# Altium project stm32f103zet6.PrjPCB
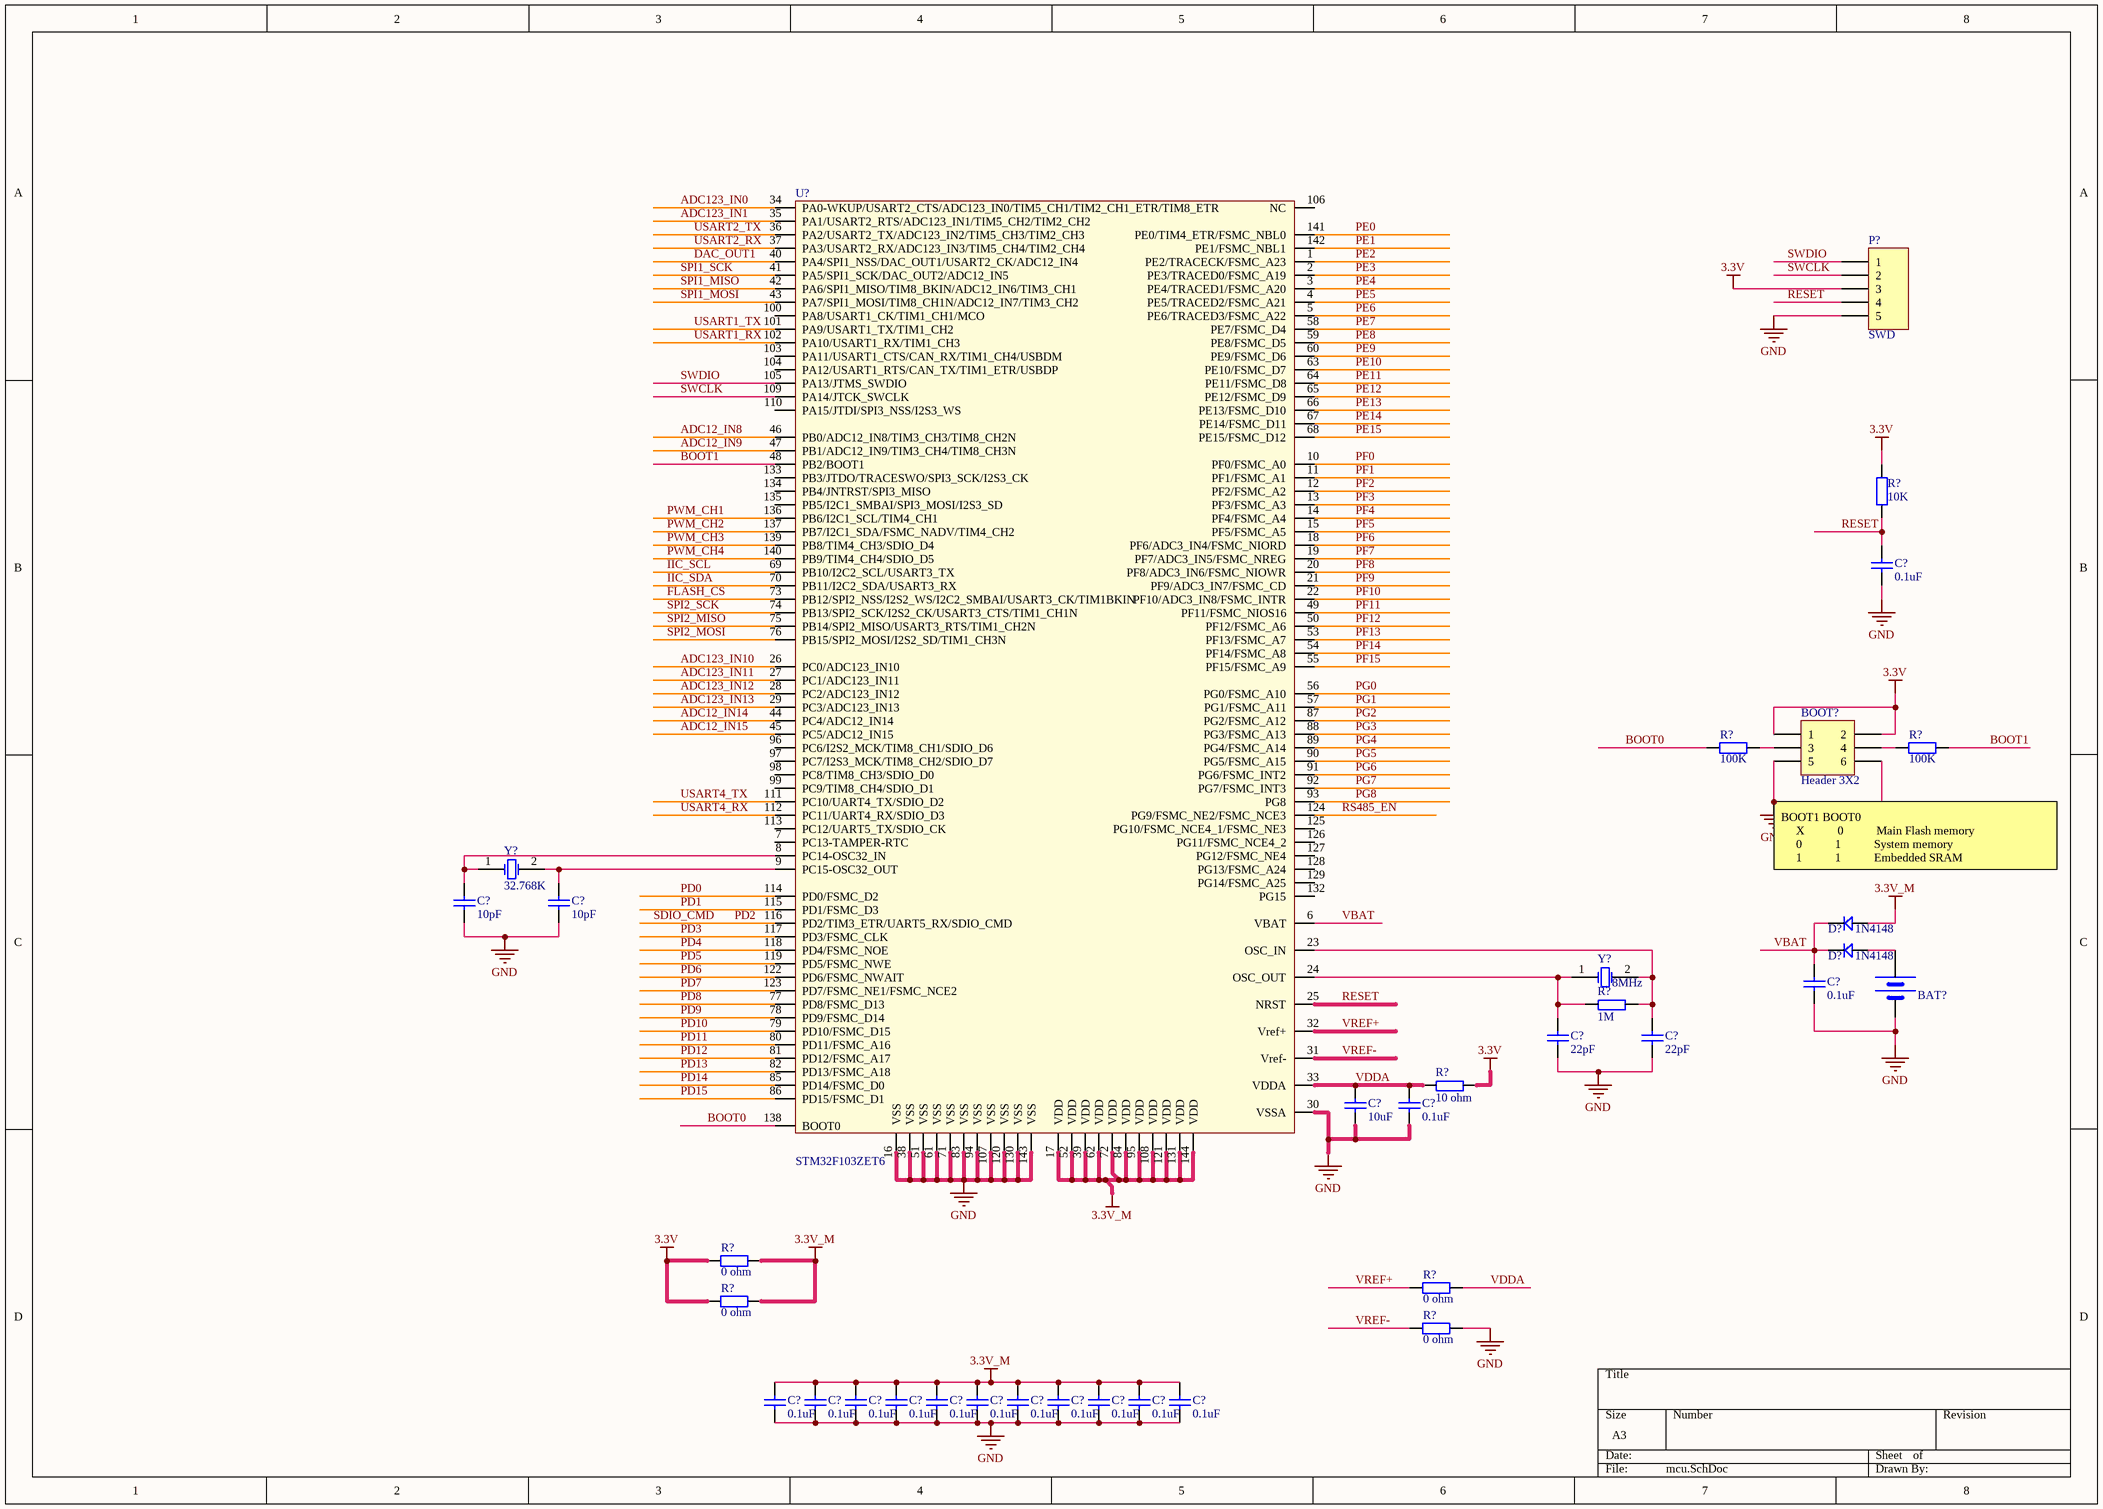
[diagram p0: mcu.SchDoc]
6 sheets, 89 parts. Net scope: hierarchical (ports join the sheet entries above them; power ports are global).
Sheets:
  mcu.SchDoc
  Top2.SchDoc
  DO.SchDoc
  DI.SchDoc
  pwm.SchDoc
  SIM900.SchDoc

## Sheet mcu.SchDoc
size A3

### Parts
(Parts that share a designator on the sheet are numbered #1, #2 ... from top to bottom, then left to right.)
BAT?  BATT  [BATM]  (value not drawn)
BOOT?  Header 3X2  [HDR2X3]
C?#1  value 0.1uF  [0805]  (hidden comment: Cap)
C?#2  value 10pF  [0805]  (hidden comment: Cap)
C?#3  value 10pF  [0805]  (hidden comment: Cap)
C?#4  value 0.1uF  [0805]  (hidden comment: Cap)
C?#5  value 22pF  [0805]  (hidden comment: Cap)
C?#6  value 22pF  [0805]  (hidden comment: Cap)
C?#7  value 10uF  [1206]  (hidden comment: Cap)
C?#8  value 0.1uF  [0805]  (hidden comment: Cap)
C?#9  value 0.1uF  [0805]  (hidden comment: Cap)
C?#10  value 0.1uF  [0805]  (hidden comment: Cap)
C?#11  value 0.1uF  [0805]  (hidden comment: Cap)
C?#12  value 0.1uF  [0805]  (hidden comment: Cap)
C?#13  value 0.1uF  [0805]  (hidden comment: Cap)
C?#14  value 0.1uF  [0805]  (hidden comment: Cap)
C?#15  value 0.1uF  [0805]  (hidden comment: Cap)
C?#16  value 0.1uF  [0805]  (hidden comment: Cap)
C?#17  value 0.1uF  [0805]  (hidden comment: Cap)
C?#18  value 0.1uF  [0805]  (hidden comment: Cap)
C?#19  value 0.1uF  [0805]  (hidden comment: Cap)
D?#1  1N4148  [DIODE_SOP]
D?#2  1N4148  [DIODE_SOP]
P?  SWD  [HDR1X5]
R?#1  value 10K  [0805]
R?#2  value 100K  [0805]
R?#3  value 100K  [0805]
R?#4  1M  [0805]
R?#5  10 ohm  [0805]
R?#6  value 0 ohm  [0805]
R?#7  value 0 ohm  [0805]
R?#8  value 0 ohm  [0805]
R?#9  value 0 ohm  [0805]
U?#1  STM32F103ZET6  [LQFP144]
Y?#1  32.768K  [XTAL32]
Y?#2  8MHz  [XTAL_US]

### Nets
3.3V: BOOT?.1 BOOT?.2 P?.3 R?#1.2 R?#5.2 R?#6.2 R?#8.2
3.3V_M: C?#9.2 C?#10.2 C?#11.2 C?#12.2 C?#13.2 C?#14.2 C?#15.2 C?#16.2 C?#17.2 C?#18.2 C?#19.2 D?#1.1 R?#6.1 R?#8.1 U?#1.17(VDD) U?#1.39(VDD) U?#1.52(VDD) U?#1.62(VDD) U?#1.72(VDD) U?#1.84(VDD) U?#1.95(VDD) U?#1.108(VDD) U?#1.121(VDD) U?#1.131(VDD) U?#1.144(VDD)
GND: BAT?.2(GND) BOOT?.5 BOOT?.6 C?#1.1 C?#2.1 C?#3.1 C?#4.1 C?#5.1 C?#6.1 C?#7.1 C?#8.1 C?#9.1 C?#10.1 C?#11.1 C?#12.1 C?#13.1 C?#14.1 C?#15.1 C?#16.1 C?#17.1 C?#18.1 C?#19.1 P?.5 R?#9.1 U?#1.16(VSS) U?#1.30(VSSA) U?#1.38(VSS) U?#1.51(VSS) U?#1.61(VSS) U?#1.71(VSS) U?#1.83(VSS) U?#1.94(VSS) U?#1.107(VSS) U?#1.120(VSS) U?#1.130(VSS) U?#1.143(VSS)
ADC12_IN8: U?#1.46(PB0/ADC12_IN8/TIM3_CH3/TIM8_CH2N)
ADC12_IN9: U?#1.47(PB1/ADC12_IN9/TIM3_CH4/TIM8_CH3N)
ADC12_IN14: U?#1.44(PC4/ADC12_IN14)
ADC12_IN15: U?#1.45(PC5/ADC12_IN15)
ADC123_IN0: U?#1.34(PA0-WKUP/USART2_CTS/ADC123_IN0/TIM5_CH1/TIM2_CH1_ETR/TIM8_ETR)
ADC123_IN1: U?#1.35(PA1/USART2_RTS/ADC123_IN1/TIM5_CH2/TIM2_CH2)
ADC123_IN10: U?#1.26(PC0/ADC123_IN10)
ADC123_IN11: U?#1.27(PC1/ADC123_IN11)
ADC123_IN12: U?#1.28(PC2/ADC123_IN12)
ADC123_IN13: U?#1.29(PC3/ADC123_IN13)
BOOT0: R?#2.2 U?#1.138(BOOT0)
BOOT1: R?#3.1 U?#1.48(PB2/BOOT1)
DAC_OUT1: U?#1.40(PA4/SPI1_NSS/DAC_OUT1/USART2_CK/ADC12_IN4)
FLASH_CS: U?#1.73(PB12/SPI2_NSS/I2S2_WS/I2C2_SMBAI/USART3_CK/TIM1BKIN)
IIC_SCL: U?#1.69(PB10/I2C2_SCL/USART3_TX)
IIC_SDA: U?#1.70(PB11/I2C2_SDA/USART3_RX)
PD0: U?#1.114(PD0/FSMC_D2)
PD1: U?#1.115(PD1/FSMC_D3)
PD2: U?#1.116(PD2/TIM3_ETR/UART5_RX/SDIO_CMD)  [also labelled SDIO_CMD]
PD3: U?#1.117(PD3/FSMC_CLK)
PD4: U?#1.118(PD4/FSMC_NOE)
PD5: U?#1.119(PD5/FSMC_NWE)
PD6: U?#1.122(PD6/FSMC_NWAIT)
PD7: U?#1.123(PD7/FSMC_NE1/FSMC_NCE2)
PD8: U?#1.77(PD8/FSMC_D13)
PD9: U?#1.78(PD9/FSMC_D14)
PD10: U?#1.79(PD10/FSMC_D15)
PD11: U?#1.80(PD11/FSMC_A16)
PD12: U?#1.81(PD12/FSMC_A17)
PD13: U?#1.82(PD13/FSMC_A18)
PD14: U?#1.85(PD14/FSMC_D0)
PD15: U?#1.86(PD15/FSMC_D1)
PE0: U?#1.141(PE0/TIM4_ETR/FSMC_NBL0)
PE1: U?#1.142(PE1/FSMC_NBL1)
PE2: U?#1.1(PE2/TRACECK/FSMC_A23)
PE3: U?#1.2(PE3/TRACED0/FSMC_A19)
PE4: U?#1.3(PE4/TRACED1/FSMC_A20)
PE5: U?#1.4(PE5/TRACED2/FSMC_A21)
PE6: U?#1.5(PE6/TRACED3/FSMC_A22)
PE7: U?#1.58(PE7/FSMC_D4)
PE8: U?#1.59(PE8/FSMC_D5)
PE9: U?#1.60(PE9/FSMC_D6)
PE10: U?#1.63(PE10/FSMC_D7)
PE11: U?#1.64(PE11/FSMC_D8)
PE12: U?#1.65(PE12/FSMC_D9)
PE13: U?#1.66(PE13/FSMC_D10)
PE14: U?#1.67(PE14/FSMC_D11)
PE15: U?#1.68(PE15/FSMC_D12)
PF0: U?#1.10(PF0/FSMC_A0)
PF1: U?#1.11(PF1/FSMC_A1)
PF2: U?#1.12(PF2/FSMC_A2)
PF3: U?#1.13(PF3/FSMC_A3)
PF4: U?#1.14(PF4/FSMC_A4)
PF5: U?#1.15(PF5/FSMC_A5)
PF6: U?#1.18(PF6/ADC3_IN4/FSMC_NIORD)
PF7: U?#1.19(PF7/ADC3_IN5/FSMC_NREG)
PF8: U?#1.20(PF8/ADC3_IN6/FSMC_NIOWR)
PF9: U?#1.21(PF9/ADC3_IN7/FSMC_CD)
PF10: U?#1.22(PF10/ADC3_IN8/FSMC_INTR)
PF11: U?#1.49(PF11/FSMC_NIOS16)
PF12: U?#1.50(PF12/FSMC_A6)
PF13: U?#1.53(PF13/FSMC_A7)
PF14: U?#1.54(PF14/FSMC_A8)
PF15: U?#1.55(PF15/FSMC_A9)
PG0: U?#1.56(PG0/FSMC_A10)
PG1: U?#1.57(PG1/FSMC_A11)
PG2: U?#1.87(PG2/FSMC_A12)
PG3: U?#1.88(PG3/FSMC_A13)
PG4: U?#1.89(PG4/FSMC_A14)
PG5: U?#1.90(PG5/FSMC_A15)
PG6: U?#1.91(PG6/FSMC_INT2)
PG7: U?#1.92(PG7/FSMC_INT3)
PG8: U?#1.93(PG8)
PWM_CH1: U?#1.136(PB6/I2C1_SCL/TIM4_CH1)
PWM_CH2: U?#1.137(PB7/I2C1_SDA/FSMC_NADV/TIM4_CH2)
PWM_CH3: U?#1.139(PB8/TIM4_CH3/SDIO_D4)
PWM_CH4: U?#1.140(PB9/TIM4_CH4/SDIO_D5)
RESET: C?#1.2 P?.4 R?#1.1 U?#1.25(NRST)
RS485_EN: U?#1.124(PG9/FSMC_NE2/FSMC_NCE3)
SPI1_MISO: U?#1.42(PA6/SPI1_MISO/TIM8_BKIN/ADC12_IN6/TIM3_CH1)
SPI1_MOSI: U?#1.43(PA7/SPI1_MOSI/TIM8_CH1N/ADC12_IN7/TIM3_CH2)
SPI1_SCK: U?#1.41(PA5/SPI1_SCK/DAC_OUT2/ADC12_IN5)
SPI2_MISO: U?#1.75(PB14/SPI2_MISO/USART3_RTS/TIM1_CH2N)
SPI2_MOSI: U?#1.76(PB15/SPI2_MOSI/I2S2_SD/TIM1_CH3N)
SPI2_SCK: U?#1.74(PB13/SPI2_SCK/I2S2_CK/USART3_CTS/TIM1_CH1N)
SWCLK: P?.2 U?#1.109(PA14/JTCK_SWCLK)
SWDIO: P?.1 U?#1.105(PA13/JTMS_SWDIO)
USART1_RX: U?#1.102(PA10/USART1_RX/TIM1_CH3)
USART1_TX: U?#1.101(PA9/USART1_TX/TIM1_CH2)
USART2_RX: U?#1.37(PA3/USART2_RX/ADC123_IN3/TIM5_CH4/TIM2_CH4)
USART2_TX: U?#1.36(PA2/USART2_TX/ADC123_IN2/TIM5_CH3/TIM2_CH3)
USART4_RX: U?#1.112(PC11/UART4_RX/SDIO_D3)
USART4_TX: U?#1.111(PC10/UART4_TX/SDIO_D2)
VBAT: C?#4.2 D?#1.2 D?#2.2 U?#1.6(VBAT)
VDDA: C?#7.2 C?#8.2 R?#5.1 R?#7.1 U?#1.33(VDDA)
VREF+: R?#7.2 U?#1.32(Vref+)
VREF-: R?#9.2 U?#1.31(Vref-)
NetBAT?_1: BAT?.1(VCC) D?#2.1
NetBOOT?_3: BOOT?.3 R?#2.1
NetBOOT?_4: BOOT?.4 R?#3.2
NetC?#2_2: C?#2.2 U?#1.8(PC14-OSC32_IN) Y?#1.1(OSC1)
NetC?#3_2: C?#3.2 U?#1.9(PC15-OSC32_OUT) Y?#1.2(OSC2)
NetC?#5_2: C?#5.2 R?#4.1 U?#1.24(OSC_OUT) Y?#2.1(OSC1)
NetC?#6_2: C?#6.2 R?#4.2 U?#1.23(OSC_IN) Y?#2.2(OSC2)

Not connected (* = marked no-connect by the designer): U?#1 7(PC13-TAMPER-RTC) 96(PC6/I2S2_MCK/TIM8_CH1/SDIO_D6) 97(PC7/I2S3_MCK/TIM8_CH2/SDIO_D7) 98(PC8/TIM8_CH3/SDIO_D0) 99(PC9/TIM8_CH4/SDIO_D1) 100(PA8/USART1_CK/TIM1_CH1/MCO) 103(PA11/USART1_CTS/CAN_RX/TIM1_CH4/USBDM) 104(PA12/USART1_RTS/CAN_TX/TIM1_ETR/USBDP) 106(NC) 110(PA15/JTDI/SPI3_NSS/I2S3_WS) 113(PC12/UART5_TX/SDIO_CK) 125(PG10/FSMC_NCE4_1/FSMC_NE3) 126(PG11/FSMC_NCE4_2) 127(PG12/FSMC_NE4) 128(PG13/FSMC_A24) 129(PG14/FSMC_A25) 132(PG15) 133(PB3/JTDO/TRACESWO/SPI3_SCK/I2S3_CK) 134(PB4/JNTRST/SPI3_MISO) 135(PB5/I2C1_SMBAI/SPI3_MOSI/I2S3_SD)

### Notes on the sheet
- BOOT1 BOOT0
  X           0           Main Flash memory
  0           1           System memory
  1           1           Embedded SRAM

### Library data of the parts
BAT? = BAT
BOOT? = Header 3X2: Header, 3-Pin, Dual row; LatestRevisionDate: 17-Jul-2002; LatestRevisionNote: Re-released for DXP Platform.; Publisher: Altium Limited
C?#1-C?#19 = Cap: Capacitor; Published: 8-Jun-2000; LatestRevisionDate: 17-Jul-2002; LatestRevisionNote: Re-released for DXP Platform.; PackageReference: RAD-0.3; Publisher: Altium Limited; PackageDescription: Radial Cap, Thru-Hole; 2 Leads; 0.3 in Pin Spacing
D?#1 D?#2 = D
P? = Header 5: Header, 5-Pin; LatestRevisionDate: 17-Jul-2002; LatestRevisionNote: Re-released for DXP Platform.; Publisher: Altium Limited
R?#1-R?#3 R?#6-R?#9 = Res2: Resistor; Published: 8-Jun-2000; LatestRevisionDate: 17-Jul-2002; LatestRevisionNote: Re-released for DXP Platform.; PackageReference: AXIAL-0.4; Publisher: Altium Limited; PackageDescription: Axial Device, Thru-Hole; 2 Leads; 0.4 in Pin Spacing
R?#4 R?#5 = R
Y?#1 = XTAL_1: Crystal Oscillator; Published: 8-Jun-2000; LatestRevisionDate: 17-Jul-2002; LatestRevisionNote: Re-released for DXP Platform.; Publisher: Altium Limited
Y?#2 = XTAL: Crystal Oscillator; Published: 8-Jun-2000; LatestRevisionDate: 17-Jul-2002; LatestRevisionNote: Re-released for DXP Platform.; Publisher: Altium Limited

## Sheet Top2.SchDoc
size A3
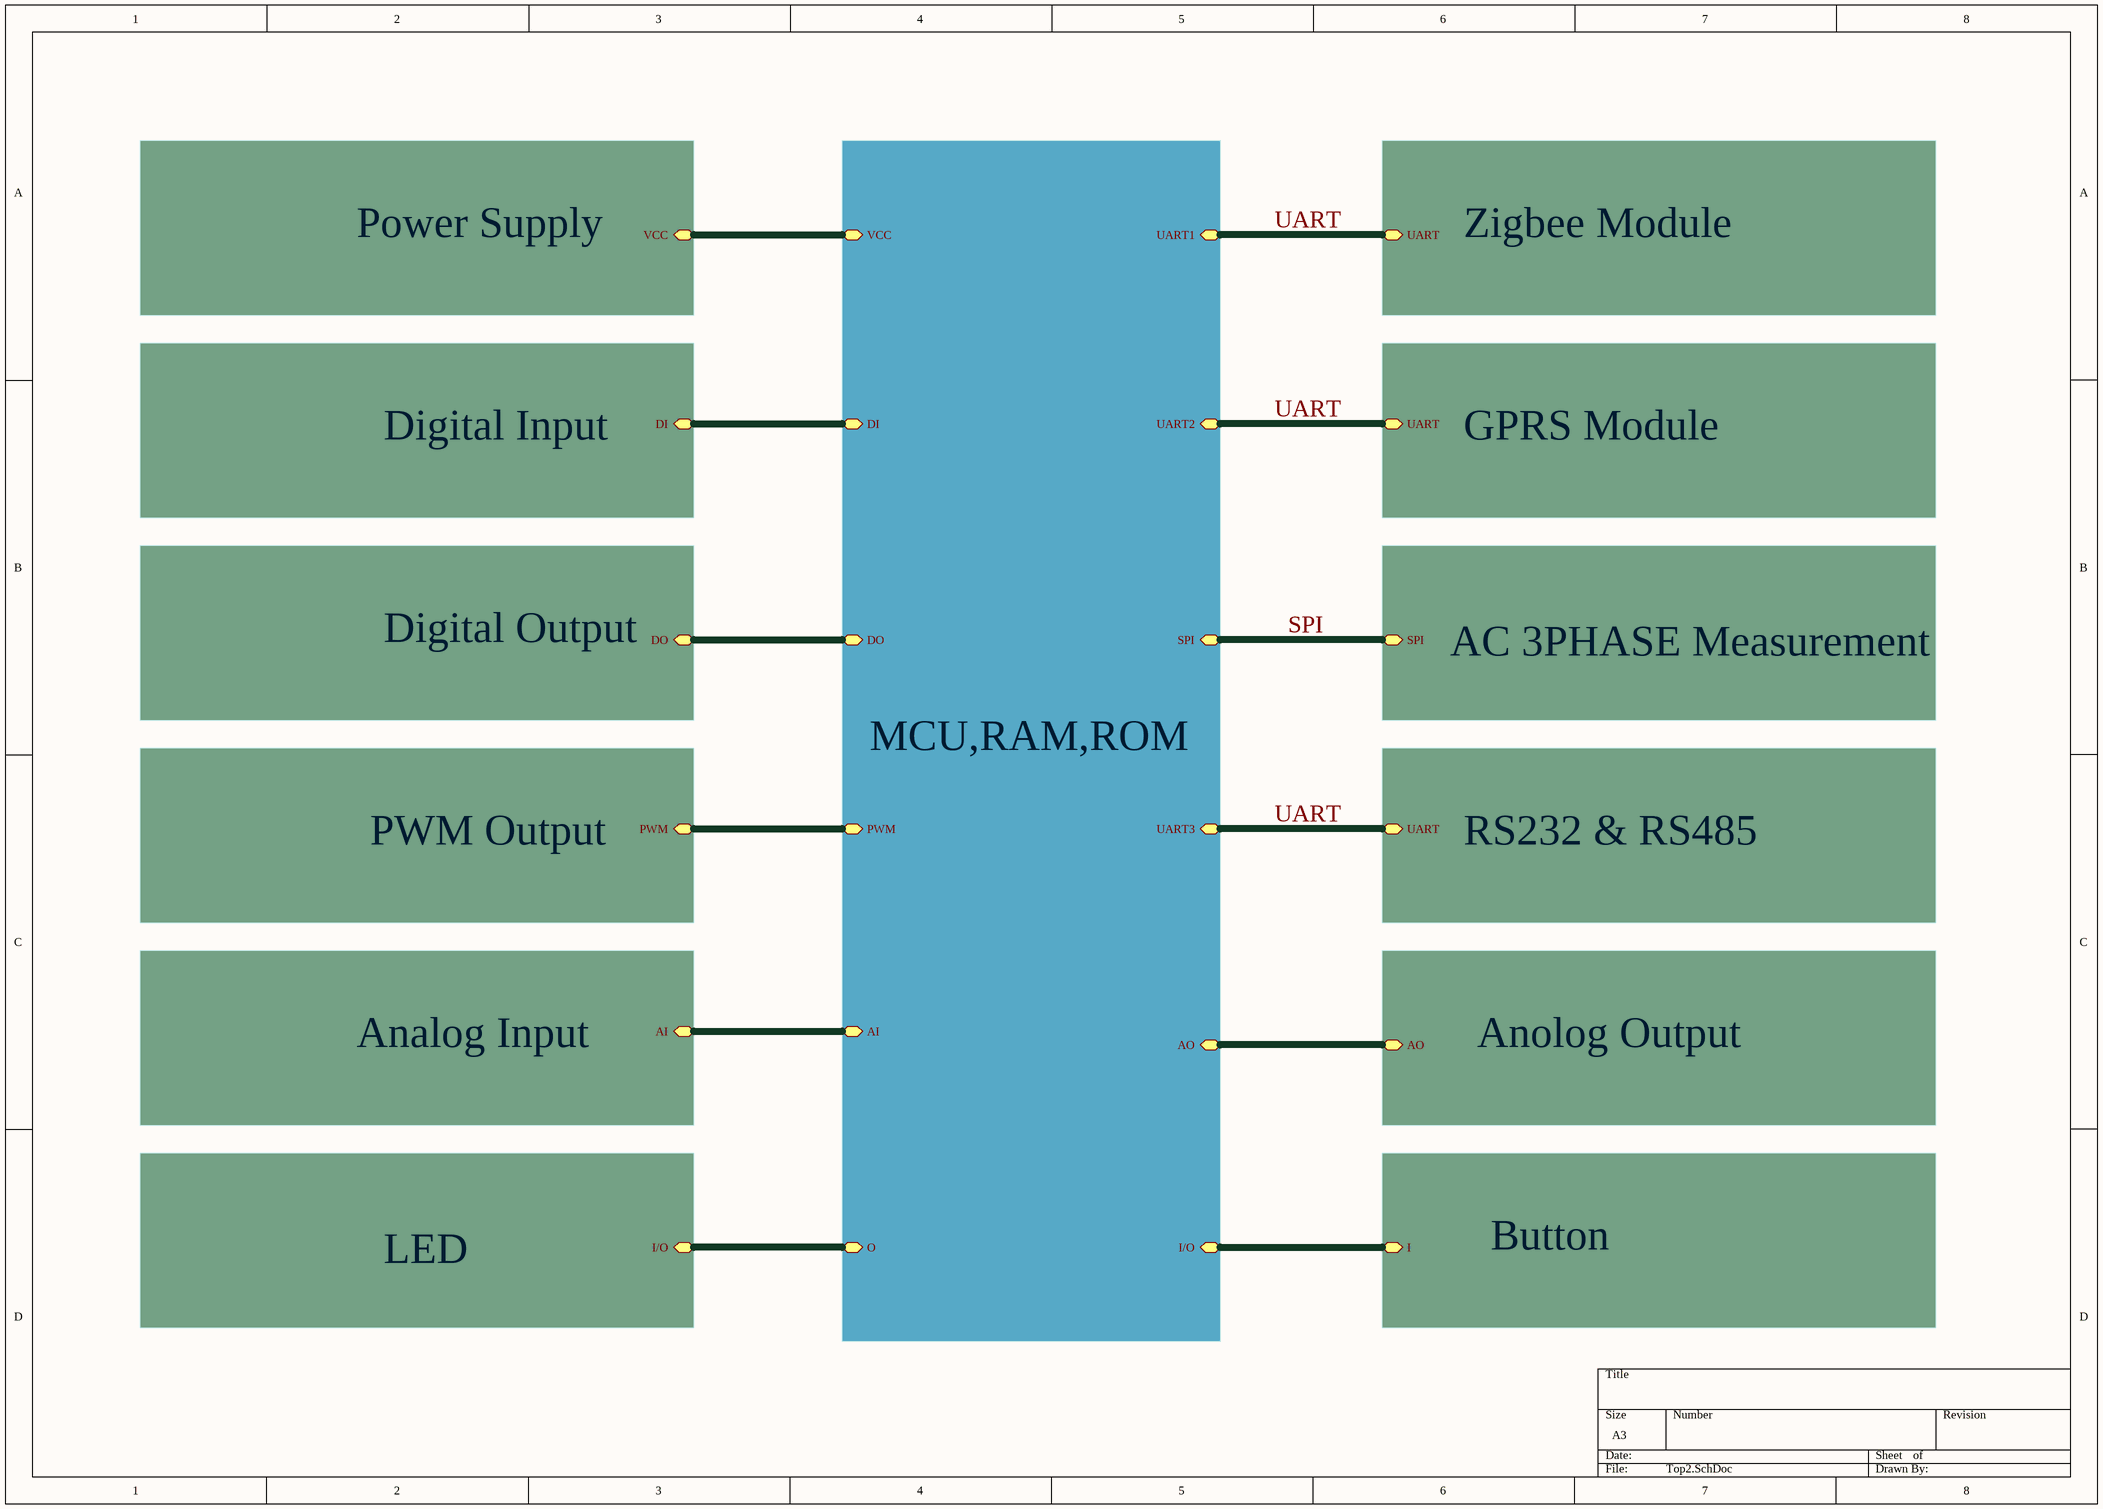
[diagram p1: Top2.SchDoc]

### Sub-sheets
AC 3PHASE Measurement = ?: SPI
Analog Input = ?: AI
Anolog Output = ?: AO
Button = ?: I
Digital Input = ?: DI
Digital Output = ?: DO
GPRS Module = ?: UART
LED = ?: I/O
MCU,RAM,ROM = ?: DI, DO, PWM, AI, O, AO, UART3, SPI, UART2, UART1, I/O, VCC
Power Supply = ?: VCC
PWM Output = ?: PWM
RS232 & RS485 = ?: UART
Zigbee Module = ?: UART

### Nets
SPI: sheet MCU,RAM,ROM/SPI, sheet AC 3PHASE Measurement/SPI
UART: sheet MCU,RAM,ROM/UART3, sheet MCU,RAM,ROM/UART2, sheet MCU,RAM,ROM/UART1, sheet GPRS Module/UART, sheet RS232 & RS485/UART, sheet Zigbee Module/UART
(unnamed): sheet MCU,RAM,ROM/DI, sheet Digital Input/DI
(unnamed): sheet MCU,RAM,ROM/DO, sheet Digital Output/DO
(unnamed): sheet MCU,RAM,ROM/PWM, sheet PWM Output/PWM
(unnamed): sheet MCU,RAM,ROM/AI, sheet Analog Input/AI
(unnamed): sheet MCU,RAM,ROM/O, sheet LED/I/O
(unnamed): sheet MCU,RAM,ROM/AO, sheet Anolog Output/AO
(unnamed): sheet MCU,RAM,ROM/I/O, sheet Button/I
(unnamed): sheet MCU,RAM,ROM/VCC, sheet Power Supply/VCC

## Sheet DO.SchDoc
size A3
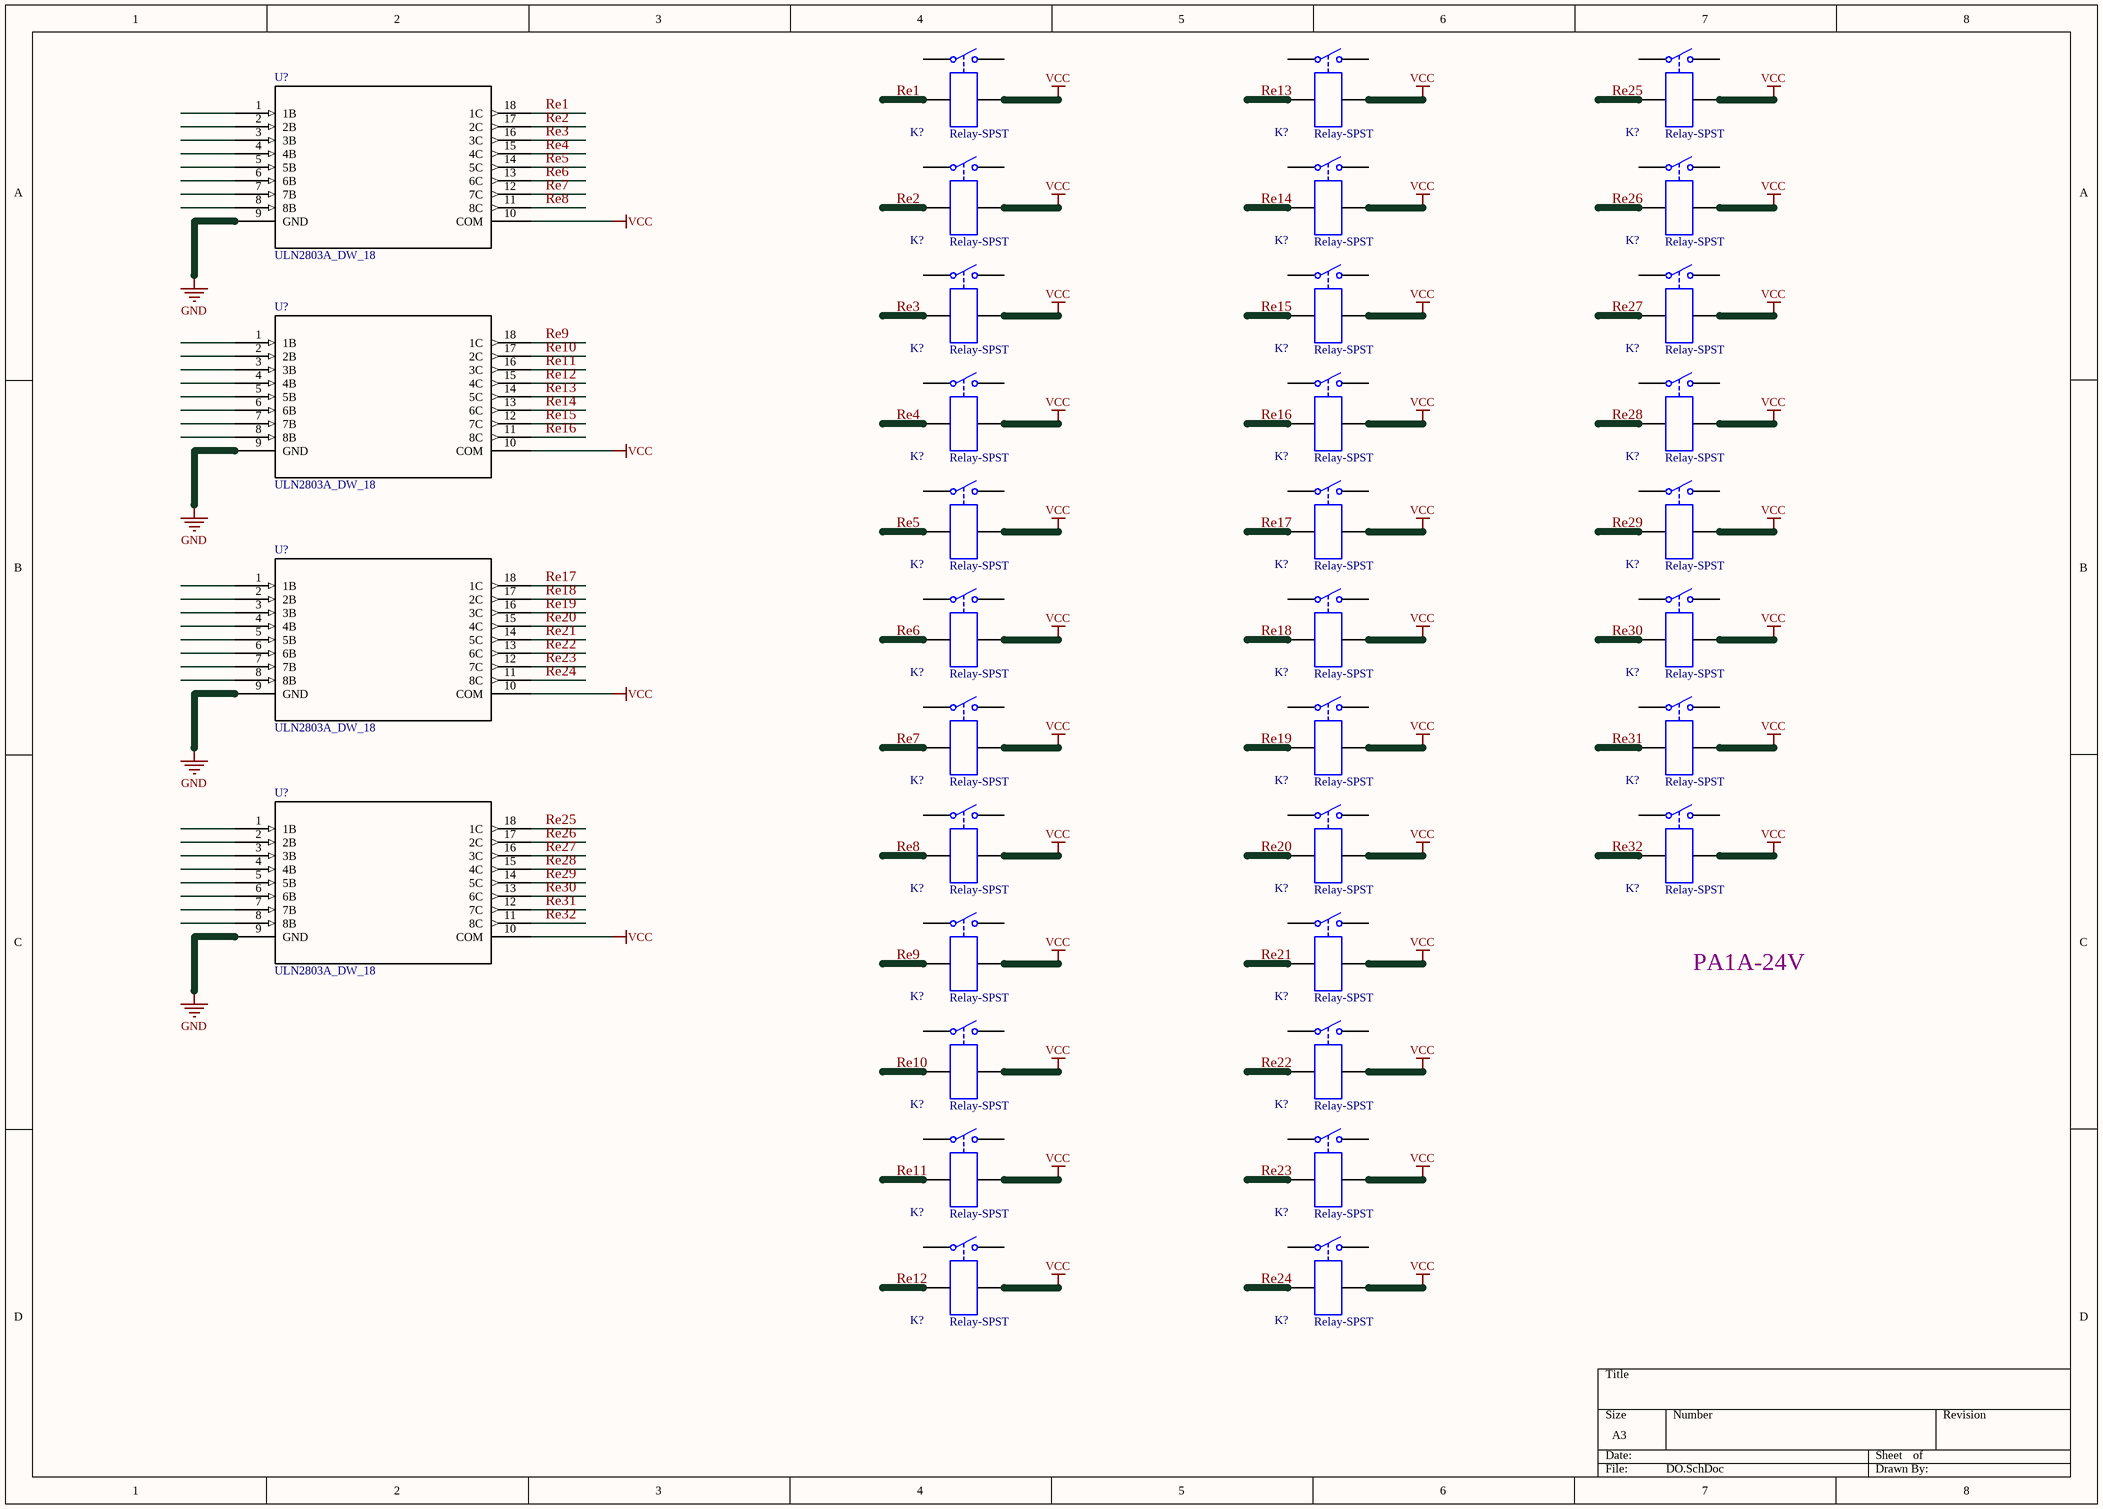
[diagram p2: DO.SchDoc]

### Parts
(Parts that share a designator on the sheet are numbered #1, #2 ... from top to bottom, then left to right.)
K?#1  Relay-SPST  [MODULE4]
K?#2  Relay-SPST  [MODULE4]
K?#3  Relay-SPST  [MODULE4]
K?#4  Relay-SPST  [MODULE4]
K?#5  Relay-SPST  [MODULE4]
K?#6  Relay-SPST  [MODULE4]
K?#7  Relay-SPST  [MODULE4]
K?#8  Relay-SPST  [MODULE4]
K?#9  Relay-SPST  [MODULE4]
K?#10  Relay-SPST  [MODULE4]
K?#11  Relay-SPST  [MODULE4]
K?#12  Relay-SPST  [MODULE4]
K?#13  Relay-SPST  [MODULE4]
K?#14  Relay-SPST  [MODULE4]
K?#15  Relay-SPST  [MODULE4]
K?#16  Relay-SPST  [MODULE4]
K?#17  Relay-SPST  [MODULE4]
K?#18  Relay-SPST  [MODULE4]
K?#19  Relay-SPST  [MODULE4]
K?#20  Relay-SPST  [MODULE4]
K?#21  Relay-SPST  [MODULE4]
K?#22  Relay-SPST  [MODULE4]
K?#23  Relay-SPST  [MODULE4]
K?#24  Relay-SPST  [MODULE4]
K?#25  Relay-SPST  [MODULE4]
K?#26  Relay-SPST  [MODULE4]
K?#27  Relay-SPST  [MODULE4]
K?#28  Relay-SPST  [MODULE4]
K?#29  Relay-SPST  [MODULE4]
K?#30  Relay-SPST  [MODULE4]
K?#31  Relay-SPST  [MODULE4]
K?#32  Relay-SPST  [MODULE4]
U?#2  ULN2803A_DW_18  [DW18]
U?#3  ULN2803A_DW_18  [DW18]
U?#4  ULN2803A_DW_18  [DW18]
U?#5  ULN2803A_DW_18  [DW18]

### Nets
GND: U?#2.9(GND) U?#3.9(GND) U?#4.9(GND) U?#5.9(GND)
VCC: K?#1.4 K?#2.4 K?#3.4 K?#4.4 K?#5.4 K?#6.4 K?#7.4 K?#8.4 K?#9.4 K?#10.4 K?#11.4 K?#12.4 K?#13.4 K?#14.4 K?#15.4 K?#16.4 K?#17.4 K?#18.4 K?#19.4 K?#20.4 K?#21.4 K?#22.4 K?#23.4 K?#24.4 K?#25.4 K?#26.4 K?#27.4 K?#28.4 K?#29.4 K?#30.4 K?#31.4 K?#32.4 U?#2.10(COM) U?#3.10(COM) U?#4.10(COM) U?#5.10(COM)
Re1: K?#1.3 U?#2.18(1C)
Re2: K?#4.3 U?#2.17(2C)
Re3: K?#7.3 U?#2.16(3C)
Re4: K?#10.3 U?#2.15(4C)
Re5: K?#13.3 U?#2.14(5C)
Re6: K?#16.3 U?#2.13(6C)
Re7: K?#19.3 U?#2.12(7C)
Re8: K?#22.3 U?#2.11(8C)
Re9: K?#25.3 U?#3.18(1C)
Re10: K?#27.3 U?#3.17(2C)
Re11: K?#29.3 U?#3.16(3C)
Re12: K?#31.3 U?#3.15(4C)
Re13: K?#2.3 U?#3.14(5C)
Re14: K?#5.3 U?#3.13(6C)
Re15: K?#8.3 U?#3.12(7C)
Re16: K?#11.3 U?#3.11(8C)
Re17: K?#14.3 U?#4.18(1C)
Re18: K?#17.3 U?#4.17(2C)
Re19: K?#20.3 U?#4.16(3C)
Re20: K?#23.3 U?#4.15(4C)
Re21: K?#26.3 U?#4.14(5C)
Re22: K?#28.3 U?#4.13(6C)
Re23: K?#30.3 U?#4.12(7C)
Re24: K?#32.3 U?#4.11(8C)
Re25: K?#3.3 U?#5.18(1C)
Re26: K?#6.3 U?#5.17(2C)
Re27: K?#9.3 U?#5.16(3C)
Re28: K?#12.3 U?#5.15(4C)
Re29: K?#15.3 U?#5.14(5C)
Re30: K?#18.3 U?#5.13(6C)
Re31: K?#21.3 U?#5.12(7C)
Re32: K?#24.3 U?#5.11(8C)

Not connected (* = marked no-connect by the designer): K?#1 1 2; K?#2 1 2; K?#3 1 2; K?#4 1 2; K?#5 1 2; K?#6 1 2; K?#7 1 2; K?#8 1 2; K?#9 1 2; K?#10 1 2; K?#11 1 2; K?#12 1 2; K?#13 1 2; K?#14 1 2; K?#15 1 2; K?#16 1 2; K?#17 1 2; K?#18 1 2; K?#19 1 2; K?#20 1 2; K?#21 1 2; K?#22 1 2; K?#23 1 2; K?#24 1 2; K?#25 1 2; K?#26 1 2; K?#27 1 2; K?#28 1 2; K?#29 1 2; K?#30 1 2; K?#31 1 2; K?#32 1 2; U?#2 1(1B) 2(2B) 3(3B) 4(4B) 5(5B) 6(6B) 7(7B) 8(8B); U?#3 1(1B) 2(2B) 3(3B) 4(4B) 5(5B) 6(6B) 7(7B) 8(8B); U?#4 1(1B) 2(2B) 3(3B) 4(4B) 5(5B) 6(6B) 7(7B) 8(8B); U?#5 1(1B) 2(2B) 3(3B) 4(4B) 5(5B) 6(6B) 7(7B) 8(8B)

### Notes on the sheet
- PA1A-24V

### Library data of the parts
K?#1-K?#32 = Relay-SPST: Single-Pole Single-Throw Relay; Published: 24-Mar-1999; LatestRevisionDate: 17-Jul-2002; LatestRevisionNote: Re-released for DXP Platform.; PackageReference: MODULE4; Publisher: Altium Limited
U?#2-U?#5 = ULN2803A_DW_18: Imported; Manufacturer: Texas Instruments; INDUSTRY_STD_PKG_TYPE: SOIC; FAMILY_NAME: PERIPHERAL DRIVER AND ACTUATOR; PIN_COUNT: 18; PACKAGE_DESIGNATOR: DW; Datasheet URL: http://www.ti.com/lit/gpn/ULN2803A; GENERIC_PART_NUMBER: ULN2803A; RefDes: RefDes; Type: DEV; Value: Value

## Sheet DI.SchDoc
size A4
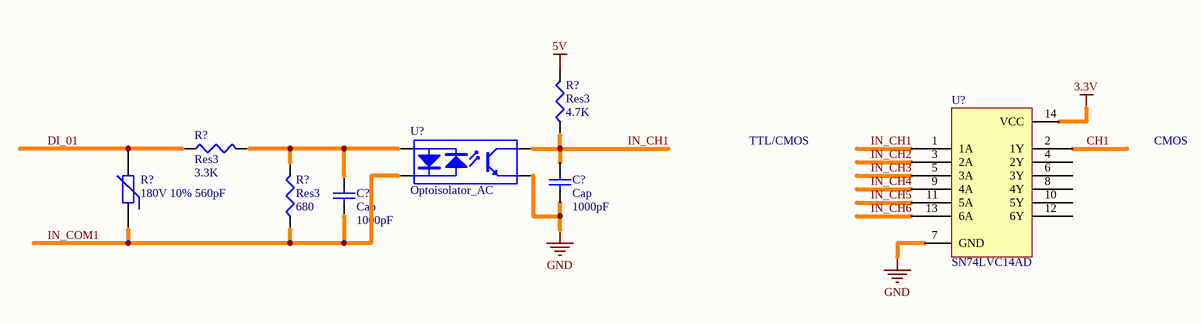
[diagram p3: DI.SchDoc]

### Parts
(Parts that share a designator on the sheet are numbered #1, #2 ... from top to bottom, then left to right.)
C?#20  Cap  value 1000pF  [RAD-0.3]
C?#21  Cap  value 1000pF  [RAD-0.3]
R?#10  Res3  value 4.7K  [J1-0603]
R?#11  Res3  value 3.3K  [J1-0603]
R?#12  180V 10% 560pF
R?#13  Res3  value 680  [J1-0603]
U?#6  SN74LVC14AD  [SOIC-14]
U?#7  Optoisolator_AC

### Nets
3.3V: U?#6.14(VCC)
5V: R?#10.2
GND: C?#20.1 U?#6.7(GND) U?#7.3(E)
CH1: U?#6.2(1Y)
DI_01: R?#11.1 R?#12.2
IN_CH1: C?#20.2 R?#10.1 U?#6.1(1A) U?#7.4(C)
IN_CH2: U?#6.3(2A)
IN_CH3: U?#6.5(3A)
IN_CH4: U?#6.9(4A)
IN_CH5: U?#6.11(5A)
IN_CH6: U?#6.13(6A)
IN_COM1: C?#21.1 R?#12.1 R?#13.1 U?#7.2(K)
NetC?#21_2: C?#21.2 R?#11.2 R?#13.2 U?#7.1(A)

Not connected (* = marked no-connect by the designer): U?#6 4(2Y) 6(3Y) 8(4Y) 10(5Y) 12(6Y)

### Notes on the sheet
- TTL/CMOS
- CMOS

### Library data of the parts
C?#20 C?#21 = Cap: Capacitor; Published: 8-Jun-2000; LatestRevisionDate: 17-Jul-2002; LatestRevisionNote: Re-released for DXP Platform.; PackageReference: RAD-0.3; Publisher: Altium Limited; PackageDescription: Radial Cap, Thru-Hole; 2 Leads; 0.3 in Pin Spacing
R?#10 R?#11 R?#13 = Res3: Resistor; Published: 8-Jun-2000; LatestRevisionDate: 29-May-2009; LatestRevisionNote: IPC-7351 Footprint Added.; PackageReference: J1-0603; Publisher: Altium Limited; PackageDescription: Chip Resistor
R?#12 = Res Varistor: Varistor (Voltage-Sensitive Resistor); Mf: Bourns; Mf P/N: 10D181K; HelpURL: http://www.bourns.com/data/global/pdfs/MOV10D.pdf
U?#6 = SN74LVC240ADBLE: SNx4LVC14A Hex Schmitt-Trigger Inverters; Mfg: TI; Mfg P/N: SN74LVC14AD; HelpURL: http://www.ti.com.cn/cn/lit/ds/symlink/sn74lvc14a.pdf
U?#7 = Optoisolator_AC: 4-Pin Phototransistor Optocoupler; HelpURL: http://www.cel.com/pdf/datasheets/ps2705a1.pdf

## Sheet pwm.SchDoc
size A4
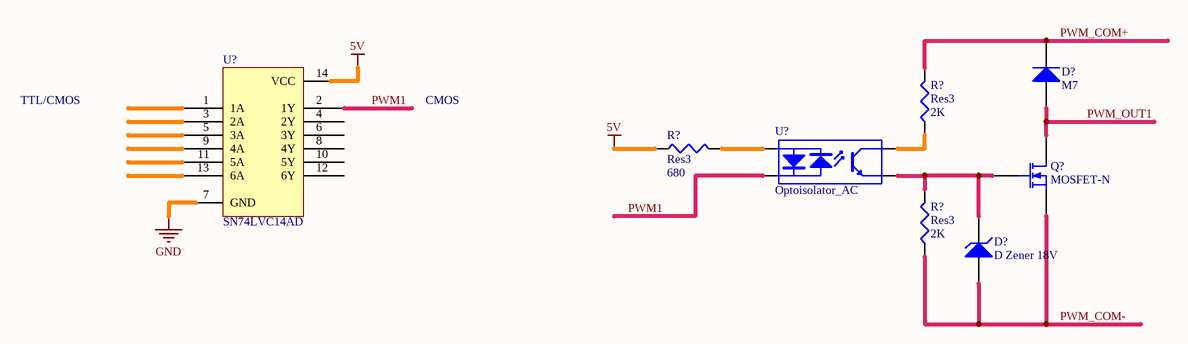
[diagram p4: pwm.SchDoc]

### Parts
(Parts that share a designator on the sheet are numbered #1, #2 ... from top to bottom, then left to right.)
D?#3  M7  [SMC]
D?#4  D Zener 18V  [DIODE-0.7]
Q?  MOSFET-N  [E3]
R?#14  Res3  value 2K  [J1-0603]
R?#15  Res3  value 680  [J1-0603]
R?#16  Res3  value 2K  [J1-0603]
U?#8  SN74LVC14AD  [SOIC-14]
U?#9  Optoisolator_AC

### Nets
5V: R?#15.1 U?#8.14(VCC)
GND: U?#8.7(GND)
PWM1: U?#8.2(1Y) U?#9.2(K)
PWM_COM+: D?#3.2(K) R?#14.2
PWM_COM-: D?#4.1(A) Q?.3(S) R?#16.1
PWM_OUT1: D?#3.1(A) Q?.1(D)
NetD?#4_2: D?#4.2(K) Q?.2(G) R?#16.2 U?#9.3(E)
NetR?#14_1: R?#14.1 U?#9.4(C)
NetR?#15_2: R?#15.2 U?#9.1(A)

Not connected (* = marked no-connect by the designer): U?#8 1(1A) 3(2A) 4(2Y) 5(3A) 6(3Y) 8(4Y) 9(4A) 10(5Y) 11(5A) 12(6Y) 13(6A)

### Notes on the sheet
- TTL/CMOS
- CMOS

### Library data of the parts
D?#3 = Diode: Default Diode; Published: 8-Jun-2000; LatestRevisionDate: 17-Jul-2002; LatestRevisionNote: Re-released for DXP Platform.; PackageVersion: Sep-1996; PackageReference: SMC; Publisher: Altium Limited; PackageDescription: DO-214-AB/SMC; 2 C-Bend Leads; Body 7.9 x 5.9 mm, inc. leads (LxW); Code_JEDEC: DO-214-AB
D?#4 = D Zener: Zener Diode; Published: 8-Jun-2000; LatestRevisionDate: 17-Jul-2002; LatestRevisionNote: Re-released for DXP Platform.; PackageReference: DIODE-0.7; Publisher: Altium Limited; PackageDescription: Diode, Thru-Hole; 2 Leads; 0.7 in Pin Spacing
Q? = MOSFET-N: N-Channel MOSFET; Published: 8-Jun-2000; LatestRevisionDate: 17-Jul-2002; LatestRevisionNote: Re-released for DXP Platform.; PackageVersion: 1995/1996; PackageReference: E3; Publisher: Altium Limited; PackageDescription: TO, Flat Index; 3 In-Line, Axial Leads; Body Dia. 4.6mm; Lead Dia. 0.5 mm (max)
R?#14-R?#16 = Res3: Resistor; Published: 8-Jun-2000; LatestRevisionDate: 29-May-2009; LatestRevisionNote: IPC-7351 Footprint Added.; PackageReference: J1-0603; Publisher: Altium Limited; PackageDescription: Chip Resistor
U?#8 = SN74LVC240ADBLE: as U?#6 on sheet DI; Mfg P/N: SN74LVC14AD; HelpURL: http://www.ti.com.cn/cn/lit/ds/symlink/sn74lvc14a.pdf
U?#9 = Optoisolator_AC: 4-Pin Phototransistor Optocoupler; HelpURL: http://www.cel.com/pdf/datasheets/ps2705a1.pdf

## Sheet SIM900.SchDoc
size A4
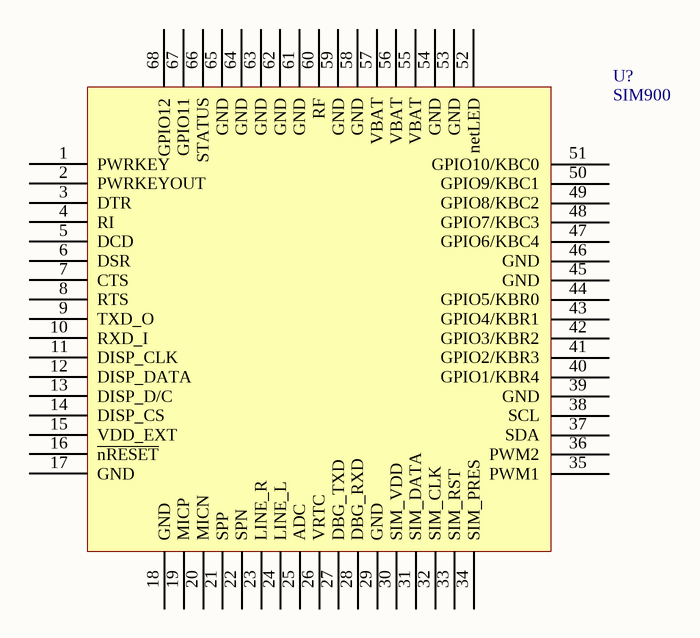
[diagram p5: SIM900.SchDoc]

### Parts
(Parts that share a designator on the sheet are numbered #1, #2 ... from top to bottom, then left to right.)
U?#10  SIM900  [GSM_900A]

### Nets

Not connected (* = marked no-connect by the designer): U?#10 1(PWRKEY) 2(PWRKEYOUT) 3(DTR) 4(RI) 5(DCD) 6(DSR) 7(CTS) 8(RTS) 9(TXD_O) 10(RXD_I) 11(DISP_CLK) 12(DISP_DATA) 13(DISP_D/C) 14(DISP_CS) 15(VDD_EXT) 16(~{nRESET}) 17(GND) 18(GND) 19(MICP) 20(MICN) 21(SPP) 22(SPN) 23(LINE_R) 24(LINE_L) 25(ADC) 26(VRTC) 27(DBG_TXD) 28(DBG_RXD) 29(GND) 30(SIM_VDD) 31(SIM_DATA) 32(SIM_CLK) 33(SIM_RST) 34(SIM_PRES) 35(PWM1) 36(PWM2) 37(SDA) 38(SCL) 39(GND) 40(GPIO1/KBR4) 41(GPIO2/KBR3) 42(GPIO3/KBR2) 43(GPIO4/KBR1) 44(GPIO5/KBR0) 45(GND) 46(GND) 47(GPIO6/KBC4) 48(GPIO7/KBC3) 49(GPIO8/KBC2) 50(GPIO9/KBC1) 51(GPIO10/KBC0) 52(netLED) 53(GND) 54(GND) 55(VBAT) 56(VBAT) 57(VBAT) 58(GND) 59(GND) 60(RF) 61(GND) 62(GND) 63(GND) 64(GND) 65(GND) 66(STATUS) 67(GPIO11) 68(GPIO12)

## Nets that join several sheets
3.3V: mcu (7 pins), DI (U?#6.14)
5V: DI (R?#10.2), pwm (R?#15.1 U?#8.14)
GND: mcu (36 pins), DO (U?#2.9 U?#3.9 U?#4.9 U?#5.9), DI (C?#20.1 U?#6.7 U?#7.3), pwm (U?#8.7)